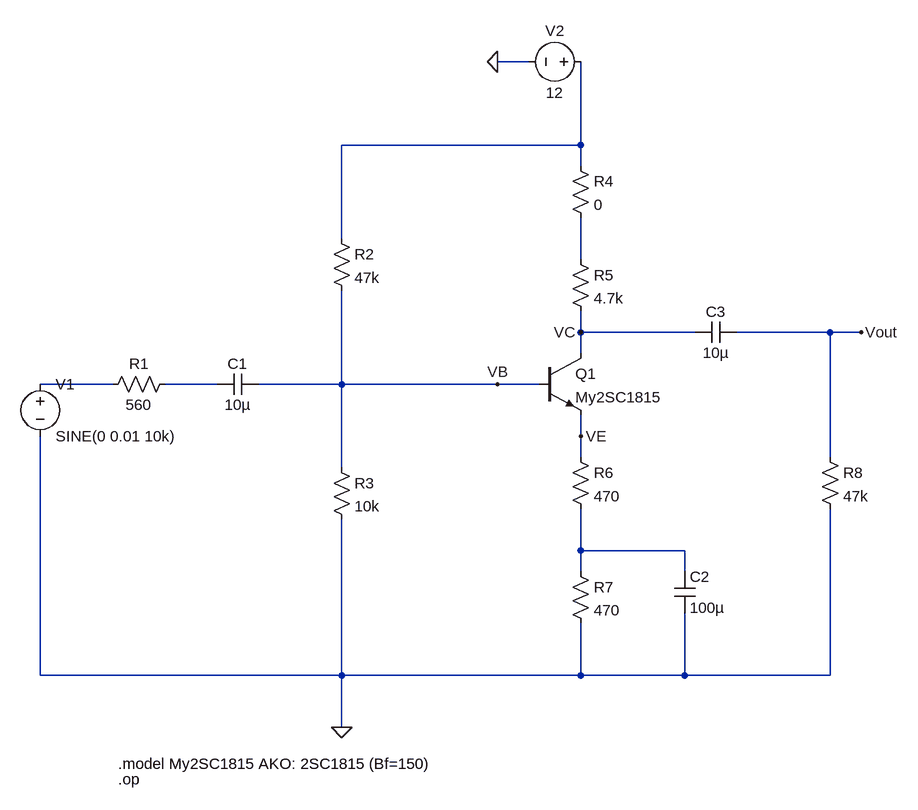
[diagram p0: schematic Draft7.asc]
Draft7.asc, the LTspice schematic file:
Version 4.1
SHEET 1 1240 736
WIRE 656 -384 608 -384
WIRE 736 -256 736 -384
WIRE 736 -256 368 -256
WIRE 736 -224 736 -256
WIRE 368 -112 368 -256
WIRE 736 -80 736 -144
WIRE 736 32 736 0
WIRE 912 32 736 32
WIRE 1120 32 976 32
WIRE 1168 32 1120 32
WIRE 736 64 736 32
WIRE 16 112 -96 112
WIRE 176 112 96 112
WIRE 368 112 368 -32
WIRE 368 112 240 112
WIRE 608 112 368 112
WIRE 672 112 608 112
WIRE 736 192 736 160
WIRE 736 224 736 192
WIRE 1120 224 1120 32
WIRE 368 240 368 112
WIRE 736 368 736 304
WIRE 896 368 736 368
WIRE 736 400 736 368
WIRE 896 400 896 368
WIRE -96 560 -96 192
WIRE 368 560 368 320
WIRE 368 560 -96 560
WIRE 736 560 736 480
WIRE 736 560 368 560
WIRE 896 560 896 464
WIRE 896 560 736 560
WIRE 1120 560 1120 304
WIRE 1120 560 896 560
WIRE 368 640 368 560
FLAG 608 -384 0
FLAG 368 640 0
FLAG 1168 32 Vout
FLAG 608 112 VB
FLAG 736 32 VC
FLAG 736 192 VE
SYMBOL res 112 96 R90
WINDOW 0 0 56 VBottom 2
WINDOW 3 32 56 VTop 2
SYMATTR InstName R1
SYMATTR Value 560
SYMBOL cap 240 96 R90
WINDOW 0 0 32 VBottom 2
WINDOW 3 32 32 VTop 2
SYMATTR InstName C1
SYMATTR Value 10µ
SYMBOL res 352 -128 R0
SYMATTR InstName R2
SYMATTR Value 47k
SYMBOL res 352 224 R0
SYMATTR InstName R3
SYMATTR Value 10k
SYMBOL res 720 -240 R0
SYMATTR InstName R4
SYMATTR Value 0
SYMBOL res 720 -96 R0
SYMATTR InstName R5
SYMATTR Value 4.7k
SYMBOL res 720 208 R0
SYMATTR InstName R6
SYMATTR Value 470
SYMBOL res 720 384 R0
SYMATTR InstName R7
SYMATTR Value 470
SYMBOL cap 880 400 R0
SYMATTR InstName C2
SYMATTR Value 100µ
SYMBOL res 1104 208 R0
SYMATTR InstName R8
SYMATTR Value 47k
SYMBOL cap 976 16 R90
WINDOW 0 0 32 VBottom 2
WINDOW 3 32 32 VTop 2
SYMATTR InstName C3
SYMATTR Value 10µ
SYMBOL npn 672 64 R0
SYMATTR InstName Q1
SYMATTR Value My2SC1815
SYMBOL voltage -96 96 R0
WINDOW 123 0 0 Left 0
WINDOW 39 0 0 Left 0
SYMATTR InstName V1
SYMATTR Value SINE(0 0.01 10k)
SYMBOL voltage 752 -384 R90
WINDOW 0 -32 56 VBottom 2
WINDOW 3 32 56 VTop 2
WINDOW 123 0 0 Left 0
WINDOW 39 0 0 Left 0
SYMATTR InstName V2
SYMATTR Value 12
TEXT 24 696 Left 2 !.model My2SC1815 AKO: 2SC1815 (Bf=150)
TEXT 24 720 Left 2 !.op

The netlist it stands for:
* Draft7.asc
R1 N004 N003 560
C1 VB N004 10µ
R2 N001 VB 47k
R3 VB 0 10k
R4 N001 N002 0
R5 N002 VC 4.7k
R6 VE N005 470
R7 N005 0 470
C2 N005 0 100µ
R8 Vout 0 47k
C3 Vout VC 10µ
Q1 VC VB VE 0 My2SC1815
V1 N003 0 SINE(0 0.01 10k)
V2 N001 0 12
.model NPN NPN
.model PNP PNP
.lib standard.bjt
.model My2SC1815 AKO: 2SC1815 (Bf=150)
.op
.backanno
.end